# Altium schematic sheet Valve.SchDoc
size A3
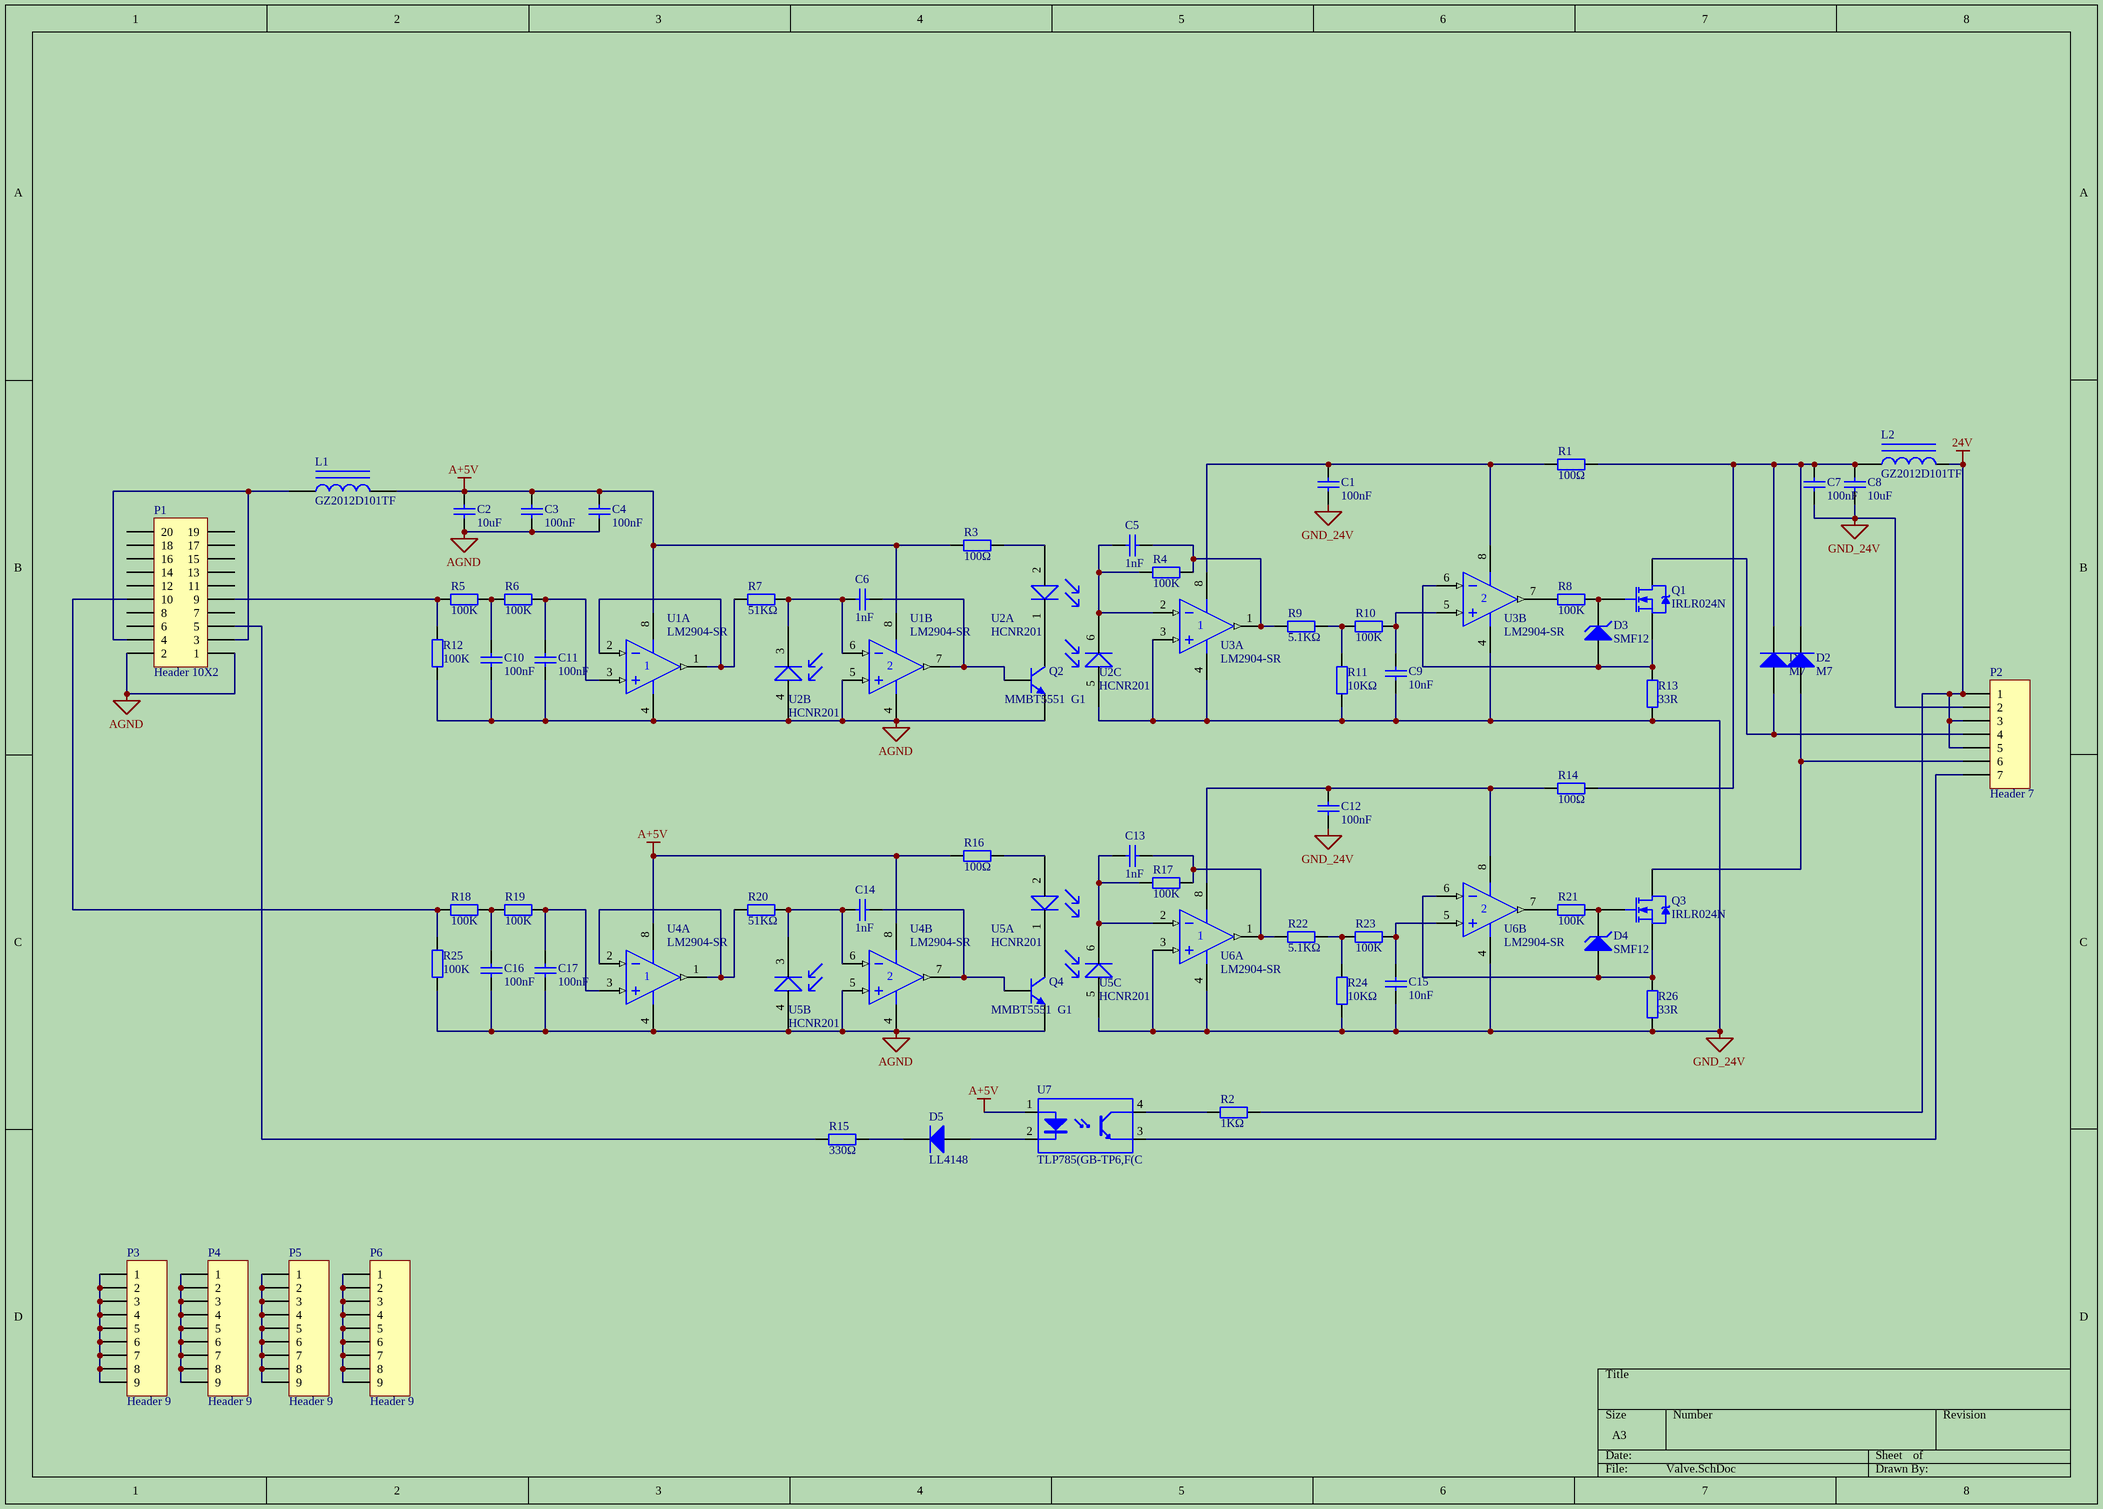
[diagram p0: Valve.SchDoc]

## Parts
C1  100nF  [0805_C]
C2  10uF  [1206_C]
C3  100nF  [0805_C]
C4  100nF  [0805_C]
C5  1nF  [0805_C]
C6  1nF  [0805_C]
C7  100nF  [0805_C]
C8  10uF  [1206_C]
C9  10nF  [0805_C]
C10  100nF  [0805_C]
C11  100nF  [0805_C]
C12  100nF  [0805_C]
C13  1nF  [0805_C]
C14  1nF  [0805_C]
C15  10nF  [0805_C]
C16  100nF  [0805_C]
C17  100nF  [0805_C]
D1  M7  [SMA(DO-214AC)_S1]
D2  M7  [SMA(DO-214AC)_S1]
D3  SMF12  [SOD-123]
D4  SMF12  [SOD-123]
D5  LL4148  [LL-34]
L1  GZ2012D101TF  [0805_L]
L2  GZ2012D101TF  [0805_L]
P1  Header 10X2  [IDC20-EJ]
P2  Header 7  [3.96-7]
P3  Header 9  [LK]
P4  Header 9  [LK]
P5  Header 9  [LK]
P6  Header 9  [LK]
Q1  IRLR024N  [TO-252AA_N]
Q2  MMBT5551  G1  [SOT-23(SOT-23-3)]
Q3  IRLR024N  [TO-252AA_N]
Q4  MMBT5551  G1  [SOT-23(SOT-23-3)]
R1  100Ω  [0805_R]
R2  1KΩ  [0805_R]
R3  100Ω  [0805_R]
R4  100K  [0805_R]
R5  100K  [0805_R]
R6  100K  [0805_R]
R7  51KΩ  [0805_R]
R8  100K  [0805_R]
R9  5.1KΩ  [0805_R]
R10  100K  [0805_R]
R11  10KΩ  [0805_R]
R12  100K  [0805_R]
R13  33R  [R2512]
R14  100Ω  [0805_R]
R15  330Ω  [0805_R]
R16  100Ω  [0805_R]
R17  100K  [0805_R]
R18  100K  [0805_R]
R19  100K  [0805_R]
R20  51KΩ  [0805_R]
R21  100K  [0805_R]
R22  5.1KΩ  [0805_R]
R23  100K  [0805_R]
R24  10KΩ  [0805_R]
R25  100K  [0805_R]
R26  33R  [R2512]
U1  LM2904-SR  [751-02_N]  (parts A,B of 2)
U2  HCNR201  [DIP-8-1]  (parts A,B,C of 3)
U3  LM2904-SR  [751-02_N]  (parts A,B of 2)
U4  LM2904-SR  [751-02_N]  (parts A,B of 2)
U5  HCNR201  [DIP-8-1]  (parts A,B,C of 3)
U6  LM2904-SR  [751-02_N]  (parts A,B of 2)
U7  TLP785(GB-TP6,F(C  [TLP785(LF6)]

## Nets
24V: L2.2 P2.1 P2.3 P2.5 R2.2
A+5V: C2.2 C3.2 C4.2 L1.2 R3.2 R16.2 U1.8(V+) U4.8(V+) U7.1(A)
AGND: C2.1 C3.1 C4.1 C10.1 C11.1 C16.1 C17.1 P1.1 P1.2 Q2.2(E) Q4.2(E) R12.1 R25.1 U1.4(V-) U1.5(IN+) U2.4(+) U4.4(V-) U4.5(IN+) U5.4(+)
GND_24V: C1.1 C7.1 C8.1 C9.1 C12.1 C15.1 P2.2 R11.2 R13.1 R24.2 R26.1 U2.5(+) U3.3(IN+) U3.4(V-) U5.5(+) U6.3(IN+) U6.4(V-)
NetC1_2: C1.2 R1.2 U3.8(V+)
NetC5_1: C5.1 R4.1 R9.2 U3.1(OUT)
NetC5_2: C5.2 R4.2 U2.6(-) U3.2(IN-)
NetC6_1: C6.1 Q2.1(B) U1.7(OUT)
NetC6_2: C6.2 R7.1 U1.6(IN-) U2.3(-)
NetC7_2: C7.2 C8.2 D1.2(K) D2.2(K) L2.1 R1.1 R14.1
NetC9_2: C9.2 R10.2 U3.5(IN+)
NetC10_2: C10.2 R5.1 R6.2
NetC11_2: C11.2 R6.1 U1.3(IN+)
NetC12_2: C12.2 R14.2 U6.8(V+)
NetC13_1: C13.1 R17.1 R22.2 U6.1(OUT)
NetC13_2: C13.2 R17.2 U5.6(-) U6.2(IN-)
NetC14_1: C14.1 Q4.1(B) U4.7(OUT)
NetC14_2: C14.2 R20.1 U4.6(IN-) U5.3(-)
NetC15_2: C15.2 R23.2 U6.5(IN+)
NetC16_2: C16.2 R18.1 R19.2
NetC17_2: C17.2 R19.1 U4.3(IN+)
NetD1_1: D1.1(A) P2.4 Q1.4(D)
NetD2_1: D2.1(A) P2.6 Q3.4(D)
NetD3_1: D3.1(A) Q1.3(S) R13.2 U3.6(IN-)
NetD3_2: D3.2(K) Q1.1(G) R8.1
NetD4_1: D4.1(A) Q3.3(S) R26.2 U6.6(IN-)
NetD4_2: D4.2(K) Q3.1(G) R21.1
NetD5_1: D5.1(A) U7.2(K)
NetD5_2: D5.2(K) R15.1
NetL1_1: L1.1 P1.3 P1.4
NetP1_5: P1.5 R15.2
NetP1_9: P1.9 R5.2 R12.2
NetP1_10: P1.10 R18.2 R25.2
NetP2_7: P2.7 U7.3(E)
NetP3_1: P3.1 P3.2 P3.3 P3.4 P3.5 P3.6 P3.7 P3.8 P3.9
NetP4_1: P4.1 P4.2 P4.3 P4.4 P4.5 P4.6 P4.7 P4.8 P4.9
NetP5_1: P5.1 P5.2 P5.3 P5.4 P5.5 P5.6 P5.7 P5.8 P5.9
NetP6_1: P6.1 P6.2 P6.3 P6.4 P6.5 P6.6 P6.7 P6.8 P6.9
NetQ2_3: Q2.3(C) U2.1(-)
NetQ4_3: Q4.3(C) U5.1(-)
NetR2_1: R2.1 U7.4(C)
NetR3_1: R3.1 U2.2(+)
NetR7_2: R7.2 U1.1(OUT) U1.2(IN-)
NetR8_2: R8.2 U3.7(OUT)
NetR9_1: R9.1 R10.1 R11.1
NetR16_1: R16.1 U5.2(+)
NetR20_2: R20.2 U4.1(OUT) U4.2(IN-)
NetR21_2: R21.2 U6.7(OUT)
NetR22_1: R22.1 R23.1 R24.1

Not connected (* = marked no-connect by the designer): P1 6 7 8 11 12 13 14 15 16 17 18 19 20

## Library data of the parts
C1 C3 C4 C7 C10-C12 C16 C17 = 0805 100nF(104) 10% 50V: 贴片电容; ComponentLink1Description: 供应商链接; ComponentLink1URL: http://www.szlcsc.com/product/details_50686.html; Package: 0805; Supplier: LC; SuppliersPartNumber: C49678
C2 C8 = 1206 10uF (106) 10% 50V: 贴片电容; ComponentLink1Description: 供应商链接; ComponentLink1URL: http://www.szlcsc.com/product/details_14236.html; Package: 1206; Supplier: LC; SuppliersPartNumber: C13585
C5 C6 C13 C14 = 0805 1nF (102) 10% 50V: 贴片电容; ComponentLink1Description: 供应商链接; ComponentLink1URL: http://www.szlcsc.com/product/details_52223.html; Package: 0805; Supplier: LC; SuppliersPartNumber: C51210
C9 C15 = 0805 10nF (103) 10% 50V: 贴片电容; ComponentLink1Description: 供应商链接; ComponentLink1URL: http://www.szlcsc.com/product/details_2062.html; Package: 0805; Supplier: LC; SuppliersPartNumber: C1710
D1 D2 = SMA(DO-214AC) M7: 二极管; 备注: 1N4007 4007 编号C2464 已经停售, 使用新物料编号C95872; ComponentLink1Description: 供应商链接; ComponentLink1URL: http://www.szlcsc.com/product/details_2841.html; Package: SMA(DO-214AC); Supplier: LC; SuppliersPartNumber: C95872
D3 D4 = D Zener: Zener Diode; Published: 8-Jun-2000; LatestRevisionDate: 17-Jul-2002; LatestRevisionNote: Re-released for DXP Platform.; PackageReference: DIODE-0.7; Publisher: Altium Limited; PackageDescription: Diode, Thru-Hole; 2 Leads; 0.7 in Pin Spacing
D5 = LL-34 LL4148 LL-34 1206: 开关二极管; ComponentLink1Description: 供应商链接; ComponentLink1URL: http://www.szlcsc.com/product/details_10338.html; Package: LL-34; Supplier: LC; SuppliersPartNumber: C9808
L1 L2 = 0805 100Ω 25% 100MHz: 贴片磁珠; ComponentLink1Description: 供应商链接; ComponentLink1URL: http://www.szlcsc.com/product/details_1367.html; Package: 0805; Supplier: LC; SuppliersPartNumber: C1015
P1 = Header 10X2: Header, 10-Pin, Dual row; LatestRevisionDate: 17-Jul-2002; LatestRevisionNote: Re-released for DXP Platform.; Publisher: Altium Limited
P2 = Header 7: Header, 7-Pin; LatestRevisionDate: 17-Jul-2002; LatestRevisionNote: Re-released for DXP Platform.; Publisher: Altium Limited
P3-P6 = Header 9: Header, 9-Pin; LatestRevisionDate: 17-Jul-2002; LatestRevisionNote: Re-released for DXP Platform.; Publisher: Altium Limited
Q1 Q3 = IRLR024N: HEXFET Power MOSFET; Note: Pin 2 is trimmed and is electrically connected to Drain.; Published: 8-Jun-2000; LatestRevisionDate: 20-Nov-2009; LatestRevisionNote: IPC-7351 Footprint Added.; PackageVersion: Feb-2003; PackageReference: TO-252AA; Publisher: Altium Limited; PackageDescription: 3-Pin HEXFET Package 2.28 mm Pitch, 9.9 mm Lead Span; Code_JEDEC: TO-252-AA; ComponentLink1Description: Manufacturer Link; ComponentLink1URL: http://www.irf.com/; ComponentLink2Description: Datasheet; ComponentLink2URL: http://www.irf.com/product-info/datasheets/data/irlr024n.pdf
Q2 Q4 = SOT-23 MMBT5551  G1: 三极管; ComponentLink1Description: 供应商链接; ComponentLink1URL: http://www.szlcsc.com/product/details_2502.html; Package: SOT-23; Supplier: LC; SuppliersPartNumber: C2145
R1 R3 R14 R16 = 0805 100Ω (1000) 1%: 贴片电阻; ComponentLink1Description: 供应商链接; ComponentLink1URL: http://www.szlcsc.com/product/details_18096.html; Package: 0805; Supplier: LC; SuppliersPartNumber: C17408
R2 = 0805 1KΩ (1001) 1%: 贴片电阻; ComponentLink1Description: 供应商链接; ComponentLink1URL: http://www.szlcsc.com/product/details_18201.html; Package: 0805; Supplier: LC; SuppliersPartNumber: C17513
R4-R6 R8 R10 R12 R17-R19 R21 R23 R25 = 0805 100KΩ (1003) 1%: 贴片电阻; ComponentLink1Description: 供应商链接; ComponentLink1URL: http://www.szlcsc.com/product/details_18095.html; Package: 0805; Supplier: LC; SuppliersPartNumber: C17407
R7 R20 = 0805 51KΩ (5102) 1%: 贴片电阻; ComponentLink1Description: 供应商链接; ComponentLink1URL: http://www.szlcsc.com/product/details_18425.html; Package: 0805; Supplier: LC; SuppliersPartNumber: C17737
R9 R22 = 0805 5.1KΩ (5101) 1%: 贴片电阻; ComponentLink1Description: 供应商链接; ComponentLink1URL: http://www.szlcsc.com/product/details_28584.html; Package: 0805; Supplier: LC; SuppliersPartNumber: C27834
R11 R24 = 0805 10KΩ (1002) 1%: 贴片电阻; ComponentLink1Description: 供应商链接; ComponentLink1URL: http://www.szlcsc.com/product/details_18102.html; Package: 0805; Supplier: LC; SuppliersPartNumber: C17414
R13 R26 = Res2: Resistor; Value: 1K; Published: 8-Jun-2000; LatestRevisionDate: 17-Jul-2002; LatestRevisionNote: Re-released for DXP Platform.; PackageReference: AXIAL-0.4; Publisher: Altium Limited
R15 = 0805 330Ω (3300) 1%: 贴片电阻; ComponentLink1Description: 供应商链接; ComponentLink1URL: http://www.szlcsc.com/product/details_18318.html; Package: 0805; Supplier: LC; SuppliersPartNumber: C17630
U1 U3 U4 U6 = LM2904D: Dual Low-Power Operational Amplifier; Published: 17-Jul-2002; LatestRevisionDate: 13-Apr-2006; LatestRevisionNote: IPC-7351 Footprint Added.; DatasheetVersion: 1988; PackageReference: 751-02; Publisher: Altium Limited; PackageDescription: 8-Pin Small Outline Integrated Circuit 1.27 mm Pitch; Code_JEDEC: MS-012-AA; Code_IPC: SOIC127P600-8; ComponentLink1Description: Manufacturer Link; ComponentLink1URL: http://www.onsemi.com/site/products/parametrics/0,4446,251,00.html; ComponentLink2Description: Datasheet; ComponentLink2URL: http://www.onsemi.com/pub/Collateral/LM358-D.PDF
U7 = TLP521: Text Field1: 80; Text Field2: 50